# Altium schematic sheet charcer-wiht-stm32.SchDoc
size A4
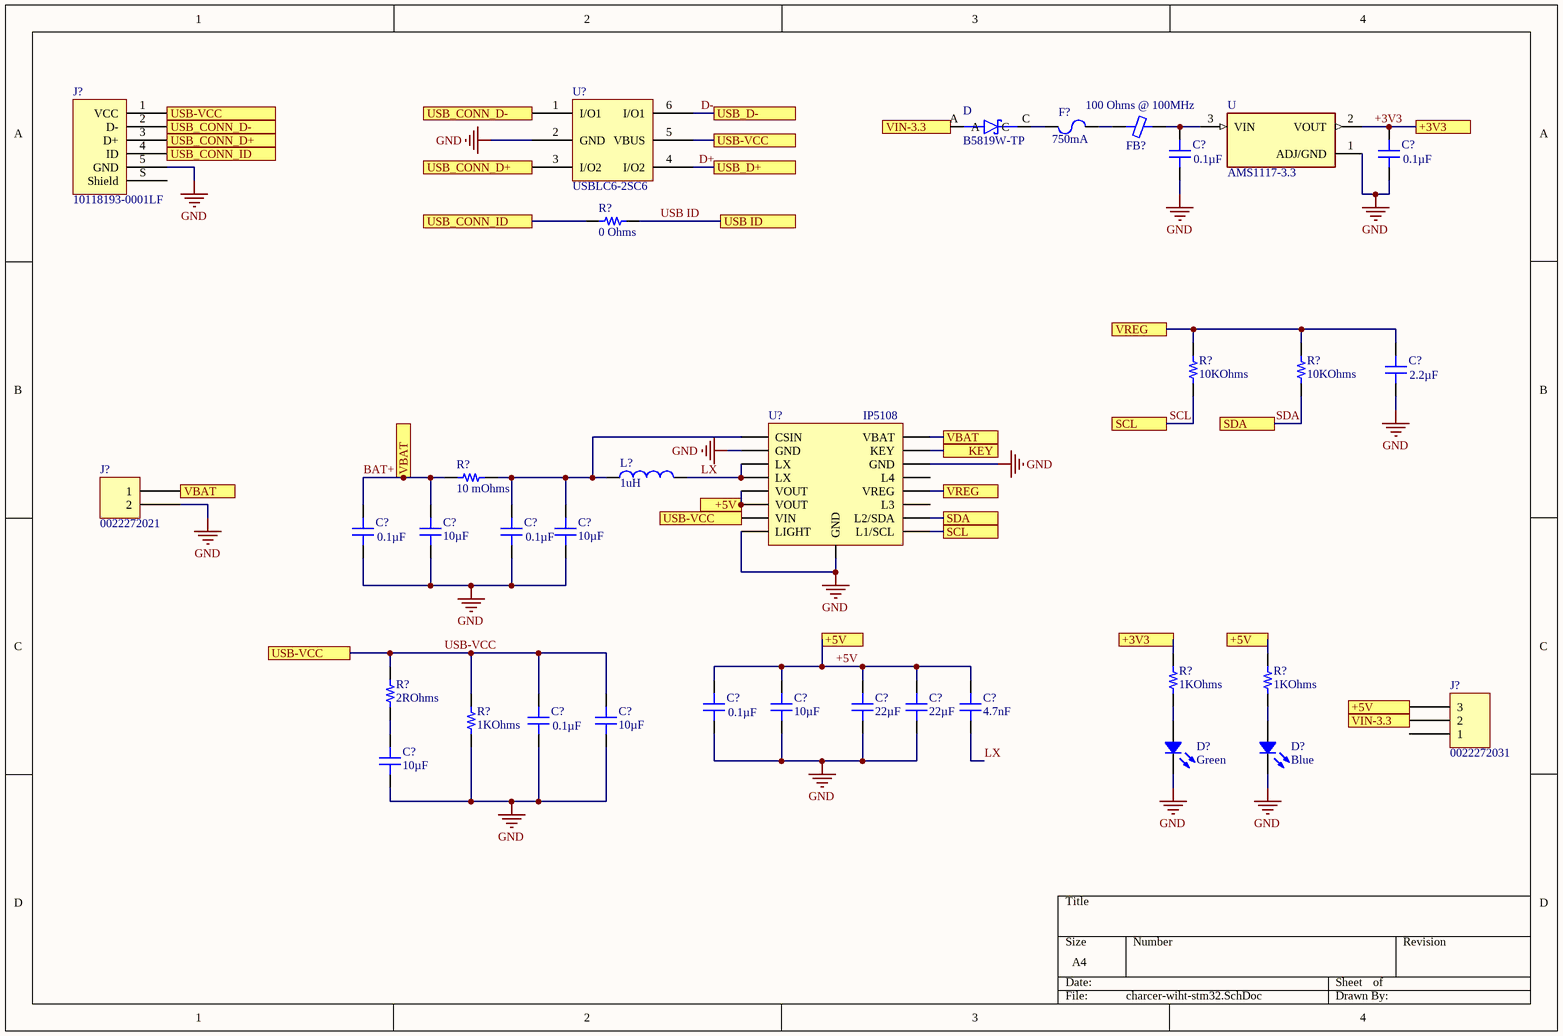
[diagram p0: charcer-wiht-stm32.SchDoc]

## Parts
(Parts that share a designator on the sheet are numbered #1, #2 ... from top to bottom, then left to right.)
C?#1  0.1µF  [CAP 0805_2012]
C?#2  0.1µF  [CAP 0805_2012]
C?#3  2.2µF  [CAP 0805_2012]
C?#4  0.1µF  [CAP 0805_2012]
C?#5  10µF  [CAP 0805_2012]
C?#6  0.1µF  [CAP 0805_2012]
C?#7  10µF  [CAP 0805_2012]
C?#8  0.1µF  [CAP 0805_2012]
C?#9  10µF  [CAP 0805_2012]
C?#10  22µF  [CAP 1206_3216 - 1.8MM]
C?#11  22µF  [CAP 1206_3216 - 1.8MM]
C?#12  4.7nF  [CAP 0805_2012]
C?#13  0.1µF  [CAP 0805_2012]
C?#14  10µF  [CAP 0805_2012]
C?#15  10µF  [CAP 0805_2012]
D  B5819W-TP  [SOD3716X135N]
D?#1  Green  [LED 0805_2012 GREEN]
D?#2  Blue  [LED 0805_2012 BLUE]
F?  750mA  [FUSE 1206_3216 0.6MM]
FB?  100 Ohms @ 100MHz  [FER 0805_2012]
J?#1  10118193-0001LF  [FCI USB 10118193-0001LF]
J?#2  0022272021  [MOLEX KK 0022272021]
J?#3  0022272031  [MOLEX KK 0022272031]
L?  1uH  [INDM7666X50N]
R?#1  0 Ohms  [RES 0402_1005]
R?#2  10KOhms  [RES 0805_2012]
R?#3  10KOhms  [RES 0805_2012]
R?#4  10 mOhms  [RES 0805_2012]
R?#5  1KOhms  [RES 0805_2012]
R?#6  1KOhms  [RES 0805_2012]
R?#7  2ROhms  [RES 0805_2012]
R?#8  1KOhms  [RES 0805_2012]
U  AMS1117-3.3  [SOT229P700X180-4N]
U?#1  USBLC6-2SC6  [SOT23-6L]
U?#2  IP5108  [SOP-16_150mil]

## Ports
+3V3, +5V, KEY, SCL, SDA, USB ID, USB-VCC, USB_CONN_D+, USB_CONN_D-, USB_CONN_ID, USB_D+, USB_D-, VBAT, VIN-3.3, VREG

## Nets
GND: C?#1.1 C?#2.1 C?#3.1 C?#4.1 C?#5.1 C?#6.1 C?#7.1 C?#8.1 C?#9.1 C?#10.1 C?#11.1 C?#13.1 C?#14.1 C?#15.1 D?#1.2 D?#2.2 J?#1.5(GND) J?#2.2 R?#8.2 U.1(ADJ/GND) U?#1.2(GND) U?#2.2(GND) U?#2.8(LIGHT) U?#2.14(GND) U?#2.17(GND)
+3V3: C?#2.2 R?#5.1 U.2(VOUT) ; port +3V3
+5V: C?#8.2 C?#9.2 C?#10.2 C?#11.2 C?#12.2 J?#3.3 R?#6.1 U?#2.5(VOUT) U?#2.6(VOUT) ; port +5V
BAT+: C?#4.2 C?#5.2 J?#2.1 R?#4.1 U?#2.16(VBAT) ; port VBAT
D+: U?#1.4(I/O2) ; port USB_D+
D-: U?#1.6(I/O1) ; port USB_D-
KEY: U?#2.15(KEY) ; port KEY
LX: C?#12.1 L?.1 U?#2.3(LX) U?#2.4(LX)
SCL: R?#2.2 U?#2.9(L1/SCL) ; port SCL
SDA: R?#3.2 U?#2.10(L2/SDA) ; port SDA
USB ID: R?#1.2 ; port USB ID
USB-VCC: C?#13.2 C?#14.2 J?#1.1(VCC) R?#7.1 R?#8.1 U?#1.5(VBUS) U?#2.7(VIN) ; port USB-VCC
USB_CONN_D+: J?#1.3(D+) U?#1.3(I/O2) ; port USB_CONN_D+
USB_CONN_D-: J?#1.2(D-) U?#1.1(I/O1) ; port USB_CONN_D-
USB_CONN_ID: J?#1.4(ID) R?#1.1 ; port USB_CONN_ID
VIN-3.3: D.A J?#3.2 ; port VIN-3.3
VREG: C?#3.2 R?#2.1 R?#3.1 U?#2.12(VREG) ; port VREG
NetC?#1_2: C?#1.2 FB?.2 U.3(VIN)
NetC?#6_2: C?#6.2 C?#7.2 L?.2 R?#4.2 U?#2.1(CSIN)
NetC?#15_2: C?#15.2 R?#7.2
NetD?#1_1: D?#1.1 R?#5.2
NetD?#2_1: D?#2.1 R?#6.2
NetD_C: D.C F?.1
NetF?_2: F?.2 FB?.1

Not connected (* = marked no-connect by the designer): J?#1 S(Shield); J?#3 1; U?#2 11(L3) 13(L4)

## Library data of the parts
C?#1 C?#2 C?#4 C?#6 C?#8 C?#13 = VJ0805Y104KFAAT: CAP CER 0.1UF 50V X7R 0805; Manufacturer: Vishay Vitramon; Tolerance: ±10%; Part Number: VJ0805Y104KFAAT; Value: 0.1µF; Applications: General Purpose; Capacitance: 0.1µF; ComponentLink1Description: Datasheet; ComponentLink1URL: http://www.vishay.com/docs/45199/vjcommercialseries.pdf; ComponentLink2Description: DigiKey Link; ComponentLink2URL: http://digikey.com/product-detail/en/vishay-vitramon/VJ0805Y104KFAAT/720-1753-1-ND/8324173; Device Package: 0805 (2012 Metric); LastUpdated: 2.9.2020 01:04:40; Lifecycle Status: Active; Minimum Order: 1; Mounting Type: Surface Mount, MLCC; Operating Temperature: -55°C ~ 150°C; Package / Case: 0805 (2012 Metric); Packaging: TapeAndReel; PartId: 3420; Part Status: Active; Price: 0.18; Series: VJ; Size / Dimension: 0.079" L x 0.049" W (2.00mm x 1.25mm); Supplier 1: DigiKey; Supplier Part Number 1: 720-1753-1-ND; Temperature Coefficient: X7R; Thickness (Max): 0.057" (1.45mm); Voltage - Rated: 50V
C?#3 = VJ0805Y104KFAAT: CAP CER 0.1UF 50V X7R 0805; Manufacturer: Vishay Vitramon; Capacitance: 0.1µF; Tolerance: ±10%; Part Number: VJ0805Y104KFAAT; Value: 2.2µF; Applications: General Purpose; ComponentLink1Description: Datasheet; ComponentLink1URL: http://www.vishay.com/docs/45199/vjcommercialseries.pdf; ComponentLink2Description: DigiKey Link; ComponentLink2URL: http://digikey.com/product-detail/en/vishay-vitramon/VJ0805Y104KFAAT/720-1753-1-ND/8324173; Device Package: 0805 (2012 Metric); LastUpdated: 2.9.2020 01:04:40; Lifecycle Status: Active; Minimum Order: 1; Mounting Type: Surface Mount, MLCC; Operating Temperature: -55°C ~ 150°C; Package / Case: 0805 (2012 Metric); Packaging: TapeAndReel; PartId: 3420; Part Status: Active; Price: 0.18; Series: VJ; Size / Dimension: 0.079" L x 0.049" W (2.00mm x 1.25mm); Supplier 1: DigiKey; Supplier Part Number 1: 720-1753-1-ND; Temperature Coefficient: X7R; Thickness (Max): 0.057" (1.45mm); Voltage - Rated: 50V
C?#5 C?#7 C?#9 C?#14 C?#15 = CL21X106KAYNNNE: CAP CER 10UF 25V X6S 0805; Manufacturer: Samsung Electro-Mechanics; Tolerance: ±10%; Part Number: CL21X106KAYNNNE; Value: 10µF; Applications: General Purpose; Capacitance: 10µF; ComponentLink1Description: Datasheet; ComponentLink1URL: http://www.samsungsem.com/kr/support/product-search/mlcc/CL21X106KAYNNNE.jsp; ComponentLink2Description: DigiKey Link; ComponentLink2URL: http://digikey.com/product-detail/en/samsung-electro-mechanics/CL21X106KAYNNNE/1276-6698-1-ND/5961557; Device Package: 0805 (2012 Metric); LastUpdated: 2.9.2020 01:04:38; Lifecycle Status: Active; Minimum Order: 1; Mounting Type: Surface Mount, MLCC; Operating Temperature: -55°C ~ 105°C; Package / Case: 0805 (2012 Metric); Packaging: TapeAndReel; PartId: 4781; Part Status: Active; Price: 0.06; Series: CL; Size / Dimension: 0.079" L x 0.049" W (2.00mm x 1.25mm); Supplier 1: DigiKey; Supplier Part Number 1: 1276-6698-1-ND; Temperature Coefficient: X6S; Thickness (Max): 0.057" (1.45mm); Voltage - Rated: 25V
C?#10 C?#11 = EMK316ABJ226KL-T: CAP CER 22UF 16V X5R 1206; Manufacturer: Taiyo Yuden; Tolerance: ±10%; Part Number: EMK316ABJ226KL-T; Value: 22µF; Applications: General Purpose; Capacitance: 22µF; ComponentLink1Description: Datasheet; ComponentLink1URL: https://www.yuden.co.jp/productdata/catalog/mlcc01_e.pdf; ComponentLink2Description: DigiKey Link; ComponentLink2URL: http://digikey.com/product-detail/en/taiyo-yuden/EMK316ABJ226KL-T/587-5521-1-ND/7067197; Device Package: 1206 (3216 Metric); LastUpdated: 2.9.2020 01:05:31; Lifecycle Status: Active; Minimum Order: 1; Mounting Type: Surface Mount, MLCC; Operating Temperature: -55°C ~ 85°C; Package / Case: 1206 (3216 Metric); Packaging: TapeAndReel; PartId: 21826; Part Status: Active; Price: 0.11; Series: M; Size / Dimension: 0.126" L x 0.063" W (3.20mm x 1.60mm); Supplier 1: DigiKey; Supplier Part Number 1: 587-5521-1-ND; Temperature Coefficient: X5R; Thickness (Max): 0.071" (1.80mm); Voltage - Rated: 16V
C?#12 = CL21X106KAYNNNE: CAP CER 10UF 25V X6S 0805; Manufacturer: Samsung Electro-Mechanics; Capacitance: 10µF; Tolerance: ±10%; Part Number: CL21X106KAYNNNE; Value: 4.7nF; Applications: General Purpose; ComponentLink1Description: Datasheet; ComponentLink1URL: http://www.samsungsem.com/kr/support/product-search/mlcc/CL21X106KAYNNNE.jsp; ComponentLink2Description: DigiKey Link; ComponentLink2URL: http://digikey.com/product-detail/en/samsung-electro-mechanics/CL21X106KAYNNNE/1276-6698-1-ND/5961557; Device Package: 0805 (2012 Metric); LastUpdated: 2.9.2020 01:04:38; Lifecycle Status: Active; Minimum Order: 1; Mounting Type: Surface Mount, MLCC; Operating Temperature: -55°C ~ 105°C; Package / Case: 0805 (2012 Metric); Packaging: TapeAndReel; PartId: 4781; Part Status: Active; Price: 0.06; Series: CL; Size / Dimension: 0.079" L x 0.049" W (2.00mm x 1.25mm); Supplier 1: DigiKey; Supplier Part Number 1: 1276-6698-1-ND; Temperature Coefficient: X6S; Thickness (Max): 0.057" (1.45mm); Voltage - Rated: 25V
D = B5819W-TP: Diode Schottky 20V 1A Surface Mount SOD-123; MF: Micro Commercial; Value: *; MP: B5819W-TP; SnapEDA_Link: https://www.snapeda.com/parts/B5819W-TP/Micro%20Commercial/view-part/214542/?ref=snap; Availability: Unavailable; Package: SOD-123 MCC; Price: None
D?#1 = SM0805UGC: LED GREEN CLEAR 0805 SMD; Manufacturer: Bivar Inc.; Configuration: Standard; Current - Test: 20mA; Lens Color: Colorless; Lens Size: 1.40mm x 1.20mm; Lens Style: Rectangle with Flat Top; Millicandela Rating: 10mcd; Viewing Angle: 130°; Voltage - Forward (Vf) (Typ): 2V; Wavelength - Dominant: 565nm; Wavelength - Peak: 563nm; Part Number: SM0805UGC; Color: Green; ComponentLink1Description: Datasheet; ComponentLink1URL: https://www.bivar.com/Files/Datasheets/SM0805UGC.pdf; ComponentLink2Description: DigiKey Link; ComponentLink2URL: http://digikey.com/product-detail/en/bivar-inc/SM0805UGC/492-1329-1-ND/2408561; Device Package: 0805 (2012 Metric); Height (Max): 1.10mm; LastUpdated: 2.9.2020 01:21:05; Lens Transparency: Clear; Lifecycle Status: Active; Minimum Order: 1; Mounting Type: Surface Mount; Package / Case: 0805 (2012 Metric); Packaging: TapeAndReel; PartId: 247; Part Status: Active; Price: 0.18; Series: -; Size / Dimension: 2.00mm L x 1.20mm W; Supplier 1: DigiKey; Supplier Part Number 1: 492-1329-1-ND; Supplier Device Package: 0805; Value: Green
D?#2 = HSMN-C170: LED BLUE DIFFUSED CHIP SMD; Manufacturer: Broadcom Limited; Configuration: Standard; Current - Test: 20mA; Lens Color: White; Lens Size: 1.40mm x 1.25mm; Lens Style: Rectangle with Flat Top; Millicandela Rating: 35mcd; Viewing Angle: 170°; Voltage - Forward (Vf) (Typ): 3.3V; Wavelength - Dominant: 470nm; Wavelength - Peak: 468nm; Part Number: HSMN-C170; Color: Blue; ComponentLink1Description: Datasheet; ComponentLink1URL: https://docs.broadcom.com/docs/AV02-0592EN; ComponentLink2Description: DigiKey Link; ComponentLink2URL: http://digikey.com/product-detail/en/broadcom-limited/HSMN-C170/516-1437-1-ND/637761; Device Package: 0805 (2012 Metric); Height (Max): 0.80mm; LastUpdated: 2.9.2020 01:20:30; Lens Transparency: Diffused; Lifecycle Status: Active; Minimum Order: 1; Mounting Type: Surface Mount; Package / Case: 0805 (2012 Metric); Packaging: TapeAndReel; PartId: 770; Part Status: Active; Price: 0.28; Series: -; Size / Dimension: 2.00mm L x 1.25mm W; Supplier 1: DigiKey; Supplier Part Number 1: 516-1437-1-ND; Supplier Device Package: Chip LED; Value: Blue
F? = 3413.0114.22: FUSE BOARD MNT 750MA 32VAC 63VDC; Manufacturer: Schurter Inc.; Approval Agency: cURus; Breaking Capacity @ Rated Voltage: 50A; Fuse Type: Board Mount (Cartridge Style Excluded); Melting I²t: 0.05; Response Time: Fast Blow; Voltage Rating - AC: 32V; Voltage Rating - DC: 63V; Part Number: 3413.0114.22; Approvals: cURus; ComponentLink1Description: Datasheet; ComponentLink1URL: http://www.schurterinc.com/bundles/snceschurter/epim/_ProdPool_/newDS/en/typ_USF_1206.pdf; ComponentLink2Description: DigiKey Link; ComponentLink2URL: http://digikey.com/product-detail/en/schurter-inc/3413.0114.22/486-1676-1-ND/2870076; Current Rating (Amps): 750mA; Device Package: 1206 (3216 Metric); LastUpdated: 2.9.2020 01:30:41; Lifecycle Status: Active; Minimum Order: 1; Mounting Type: Surface Mount; Operating Temperature: -55°C ~ 90°C; Package / Case: 1206 (3216 Metric); Packaging: TapeAndReel; Part Status: Active; Price: 0.24; Series: USF 1206; Size / Dimension: 0.126" L x 0.063" W x 0.024" H (3.20mm x 1.60mm x 0.60mm); Supplier 1: DigiKey; Supplier Part Number 1: 486-1676-1-ND
FB? = MH2029-101Y: FERRITE BEAD 100 OHM 0805 1LN; Manufacturer: Bourns Inc.; Current Rating (Max): 2A; DC Resistance (DCR) (Max): 100mOhm; Filter Type: Power, Signal Line; Number of Lines: 1; Part Number: MH2029-101Y; ComponentLink1Description: Datasheet; ComponentLink1URL: https://www.bourns.com/docs/Product-Datasheets/mh.pdf; ComponentLink2Description: DigiKey Link; ComponentLink2URL: http://digikey.com/product-detail/en/bourns-inc/MH2029-101Y/MH2029-101YCT-ND/6100092; Device Package: 0805 (2012 Metric); Height (Max): 0.043" (1.10mm); Impedance @ Frequency: 100 Ohms @ 100MHz; LastUpdated: 2.9.2020 01:18:23; Lifecycle Status: Active; Minimum Order: 1; Mounting Type: Surface Mount; Operating Temperature: -55°C ~ 125°C; Package / Case: 0805 (2012 Metric); Packaging: TapeAndReel; PartId: 1212; Part Status: Active; Price: 0.02; Series: MH; Size / Dimension: 0.079" L x 0.047" W (2.00mm x 1.20mm); Supplier 1: DigiKey; Supplier Part Number 1: MH2029-101YCT-ND; Value: 100 Ohms @ 100MHz
J?#1 = 10118193-0001LF: CONN RCPT USB2.0 MICRO B SMD R/A; Manufacturer: Amphenol ICC (FCI); Connector Type: USB - micro B; Current Rating (Amps): 1.8A per Contact; Gender: Receptacle; Mating Cycles: 10000; Number of Contacts: 5; Number of Ports: 1; Shielding: Shielded; Voltage - Rated: 100VAC; Part Number: 10118193-0001LF; ComponentLink1Description: Datasheet; ComponentLink1URL: https://cdn.amphenol-icc.com/media/wysiwyg/files/documentation/datasheet/inputoutput/io_usb_micro.pdf; ComponentLink2Description: DigiKey Link; ComponentLink2URL: //digikey.com/product-detail/en/amphenol-icc-fci/10118193-0001LF/609-4616-2-ND/2785388; Features: Solder Retention; LastUpdated: 9.12.2019 20:51:28; Lifecycle Status: 0; Minimum Order: 1; Mounting Feature: Horizontal; Mounting Type: Surface Mount, Right Angle; Through Hole; Operating Temperature: -30°C ~ 80°C; Packaging: TapeAndReel; Part Status: Active; Price: 0.21; Series: -; Specifications: USB 2.0; Supplier 1: DigiKey; Supplier Part Number 1: 609-4616-2-ND; Termination: Solder
J?#2 = 0022272021: CONN HEADER VERT 2POS 2.54MM; Manufacturer: Molex; Contact Length - Mating: 0.295" (7.49mm); Contact Length - Post: 0.140" (3.56mm); Material Flammability Rating: UL94 V-0; Number of Positions: 2; Number of Positions Loaded: All; Overall Contact Length: 0.560" (14.22mm); Pitch - Mating: 0.100" (2.54mm); Shrouding: Shrouded - 1 Wall; Style: Board to Cable/Wire; Part Number: 0022272021; ComponentLink1Description: Datasheet; ComponentLink1URL: https://www.molex.com/pdm_docs/sd/022272021_sd.pdf; ComponentLink2Description: DigiKey Link; ComponentLink2URL: http://digikey.com/product-detail/en/molex/0022272021/WM4111-ND/1130577; Connector Type: Header; Contact Finish - Mating: Tin; Contact Finish - Post: Tin; Contact Finish Thickness - Mating: 100.0µin (2.54µm); Contact Material: Brass; Contact Shape: Square; Contact Type: Male Pin; Fastening Type: Friction Lock; Insulation Color: Natural; Insulation Height: 0.461" (11.70mm); Insulation Material: Polyamide (PA), Nylon; LastUpdated: 12.1.2020 23:51:43; Lifecycle Status: Active; Minimum Order: 1; Mounting Type: Through Hole; Number of Rows: 1; Packaging: Bulk; PartId: 76; Part Status: Active; Price: 0.27; Series: KK 6410; Supplier 1: DigiKey; Supplier Part Number 1: WM4111-ND; Termination: Solder
J?#3 = 0022272031: CONN HEADER VERT 3POS 2.54MM; Manufacturer: Molex; Contact Length - Mating: 0.295" (7.49mm); Contact Length - Post: 0.140" (3.56mm); Material Flammability Rating: UL94 V-0; Number of Positions: 3; Number of Positions Loaded: All; Overall Contact Length: 0.560" (14.22mm); Pitch - Mating: 0.100" (2.54mm); Shrouding: Shrouded - 1 Wall; Style: Board to Cable/Wire; Part Number: 0022272031; ComponentLink1Description: Datasheet; ComponentLink1URL: https://www.molex.com/pdm_docs/sd/022272031_sd.pdf; ComponentLink2Description: DigiKey Link; ComponentLink2URL: http://digikey.com/product-detail/en/molex/0022272031/WM4112-ND/1130578; Connector Type: Header; Contact Finish - Mating: Tin; Contact Finish - Post: Tin; Contact Finish Thickness - Mating: 100.0µin (2.54µm); Contact Material: Brass; Contact Shape: Square; Contact Type: Male Pin; Fastening Type: Friction Lock; Insulation Color: Natural; Insulation Height: 0.461" (11.70mm); Insulation Material: Polyamide (PA), Nylon; LastUpdated: 12.1.2020 23:51:54; Lifecycle Status: Active; Minimum Order: 1; Mounting Type: Through Hole; Number of Rows: 1; Packaging: Bulk; PartId: 77; Part Status: Active; Price: 0.37; Series: KK 6410; Supplier 1: DigiKey; Supplier Part Number 1: WM4112-ND; Termination: Solder
L? = SMPI06050-1R0M: Fixed Inductors .1uH 20%; Manufacturer: CORE MASTER; Core Material: Ferrite; DC Resistance (DCR): 7mR; Shielding: Shielded; Inductance: 100nH; Max DC Current: 40A; Test Frequency: 100kHz; Current Rating: 18A; Self Resonant Frequency: 5MHz; Resistance: 3mR; Supplier 1: ozdisan; Manufacturer Part Number: SMPI06050-1R0M; RoHS: Yes; Category: Fixed Inductors; Mount: Surface Mount; Case/Package: NONSTANDARD; Number of Pins: 2; Case Code (Imperial): 2525; Case Code (Metric): 6363; Min Operating Temperature: -55°C; Max Operating Temperature: 125°C; Package Quantity: 2000; Packaging: Tape and Reel; Termination: SMD/SMT; Tolerance: 20%; Saturation Current: 40A; Inductance Tolerance: 20%; RMS Current (Irms): 18A; Length: 6.86mm; Width: 0.255inch; Height: 1.8mm; Height - Seated (Max): 0.071inch; Depth: 6.72mm; Radiation Hardening: No; Lead Free: Lead Free; REACH SVHC: Unknown; ComponentLink1URL: https://datasheet.ciiva.com/11798/0900766b8102c932-11798378.pdf?src-supplier=RSComponents; ComponentLink1Description: https://datasheet.ciiva.com/11798/0900766b8102c932-11798378.pdf?src-supplier=RSComponents; ComponentLink2URL: https://datasheet.ciiva.com/1076/ih25ah01-1076900.pdf?src-supplier=Digi-Key; ComponentLink2Description: https://datasheet.ciiva.com/1076/ih25ah01-1076900.pdf?src-supplier=Digi-Key; ComponentLink3URL: https://datasheet.ciiva.com/8017/425589-8017240.pdf?src-supplier=Element14; ComponentLink3Description: https://datasheet.ciiva.com/8017/425589-8017240.pdf?src-supplier=Element14; ComponentLink4URL: https://datasheet.ciiva.com/17269/ih25ah01-17269371.pdf?src-supplier=Avnet+Europe; ComponentLink4Description: https://datasheet.ciiva.com/17269/ih25ah01-17269371.pdf?src-supplier=Avnet+Europe; ComponentLink5URL: https://datasheet.ciiva.com/16460/ih25ah01-16460077.pdf?src-supplier=Future+Electronics; ComponentLink5Description: https://datasheet.ciiva.com/16460/ih25ah01-16460077.pdf?src-supplier=Future+Electronics; ComponentLink6URL: https://datasheet.ciiva.com/8496/ih25ah01-8496206.pdf?src-supplier=Avnet; ComponentLink6Description: https://datasheet.ciiva.com/8496/ih25ah01-8496206.pdf?src-supplier=Avnet; Stock 1: 2000; Supplier Part Number 1: SMPI06050-1R0M
R?#1 = CRCW04020000Z0EDHP: RES SMD 0 OHM JUMPER 1/5W 0402; Manufacturer: Vishay Dale; Power (Watts): 0.2W, 1/5W; Part Number: CRCW04020000Z0EDHP; Value: 0 Ohms; ComponentLink1Description: Datasheet; ComponentLink1URL: http://www.vishay.com/docs/20043/crcwhpe3.pdf; ComponentLink2Description: DigiKey Link; ComponentLink2URL: http://digikey.com/product-detail/en/vishay-dale/CRCW04020000Z0EDHP/541-0.0YBCT-ND/2223008; Composition: Thick Film; Device Package: 0402 (1005 Metric); Features: Automotive AEC-Q200, Pulse Withstanding; Height - Seated (Max): 0.016" (0.40mm); LastUpdated: 2.9.2020 01:08:09; Lifecycle Status: Active; Minimum Order: 1; Number of Terminations: 2; Operating Temperature: -55°C ~ 155°C; Package / Case: 0402 (1005 Metric); Packaging: TapeAndReel; PartId: 3131; Part Status: Active; Price: 0.01; Ratings: AEC-Q200; Resistance: 0 Ohms; Series: CRCW-HP; Size / Dimension: 0.039" L x 0.020" W (1.00mm x 0.50mm); Supplier 1: DigiKey; Supplier Part Number 1: 541-0.0YBCT-ND; Supplier Device Package: 0402; Tolerance: Jumper
R?#2 R?#3 R?#5-R?#8 = RL0805FR-070R01L: RES 0.01 OHM 1% 1/8W 0805; Manufacturer: Yageo; Power (Watts): 0.125W, 1/8W; Resistance: 10 mOhms; Temperature Coefficient: ±1500ppm/°C; Part Number: RL0805FR-070R01L; ComponentLink1Description: Datasheet; ComponentLink1URL: http://www.yageo.com/documents/recent/PYu-RL_Group_521_RoHS_L_2.pdf; ComponentLink2Description: DigiKey Link; ComponentLink2URL: http://digikey.com/product-detail/en/yageo/RL0805FR-070R01L/311-0.01SCT-ND/2827993; Composition: Thick Film; Device Package: 0805 (2012 Metric); Features: Automotive AEC-Q200, Current Sense, Moisture Resistant; Height - Seated (Max): 0.024" (0.60mm); LastUpdated: 2.9.2020 01:15:18; Lifecycle Status: Active; Minimum Order: 1; Number of Terminations: 2; Operating Temperature: -55°C ~ 155°C; Package / Case: 0805 (2012 Metric); Packaging: TapeAndReel; PartId: 30376; Part Status: Active; Price: 0.09; Ratings: AEC-Q200; Series: RL; Size / Dimension: 0.079" L x 0.049" W (2.00mm x 1.25mm); Supplier 1: DigiKey; Supplier Part Number 1: 311-0.01SCT-ND; Supplier Device Package: 0805; Tolerance: ±1%
  R?#2 R?#3: Value: 10KOhms
  R?#5 R?#6 R?#8: Value: 1KOhms
  R?#7: Value: 2ROhms
R?#4 = RL0805FR-070R01L: RES 0.01 OHM 1% 1/8W 0805; Manufacturer: Yageo; Power (Watts): 0.125W, 1/8W; Temperature Coefficient: ±1500ppm/°C; Part Number: RL0805FR-070R01L; Value: 10 mOhms; ComponentLink1Description: Datasheet; ComponentLink1URL: http://www.yageo.com/documents/recent/PYu-RL_Group_521_RoHS_L_2.pdf; ComponentLink2Description: DigiKey Link; ComponentLink2URL: http://digikey.com/product-detail/en/yageo/RL0805FR-070R01L/311-0.01SCT-ND/2827993; Composition: Thick Film; Device Package: 0805 (2012 Metric); Features: Automotive AEC-Q200, Current Sense, Moisture Resistant; Height - Seated (Max): 0.024" (0.60mm); LastUpdated: 2.9.2020 01:15:18; Lifecycle Status: Active; Minimum Order: 1; Number of Terminations: 2; Operating Temperature: -55°C ~ 155°C; Package / Case: 0805 (2012 Metric); Packaging: TapeAndReel; PartId: 30376; Part Status: Active; Price: 0.09; Ratings: AEC-Q200; Resistance: 10 mOhms; Series: RL; Size / Dimension: 0.079" L x 0.049" W (2.00mm x 1.25mm); Supplier 1: DigiKey; Supplier Part Number 1: 311-0.01SCT-ND; Supplier Device Package: 0805; Tolerance: ±1%
U = AMS1117-3.3: Sot223/Pkg 1-Amp 3.3-Volt Low Drop Out Voltage Regulatator; MF: Advanced Monolithic Systems; Price: None; Package: None; Value: *; MP: AMS1117-3.3; Availability: Unavailable; SnapEDA_Link: https://www.snapeda.com/parts/AMS1117-3.3/Advanced%20Monolithic%20Systems/view-part/53450/?ref=snap
U?#1 = USBLC6-2SC6: USBLC6 Series 4 Line 6 V Uni / Bi-Directional ESD Protection - SOT-23-6; Manufacturer: STMicroelectronics; Capacitance: 4pF; Direction: Unidirectional; Clamping Voltage: 17V; Number of Bidirectional Channels: 4; Reverse Standoff Voltage: 5V; Min Breakdown Voltage: 6V; Power Line Protection: Yes; Leakage Current: 150nA; Peak Pulse Current: 5A; Operating Supply Voltage: 860mV; Test Current: 1mA; Max Reverse Leakage Current: 2uA; Number of Elements: 1; Polarity: Unidirectional,Bidirectional; Max Breakdown Voltage: 10V; Supplier 1: Avnet; Manufacturer Part Number: USBLC6-2SC6; RoHS: Yes; Category: ESD and Circuit Protection ICs; Stock 1: 147000; Pricing 1: 3000=0,24113, 6000=0,23936, 12000=0,23732, 18000=0,23404, 24000=0,23049, 30000=0,22872, 300000=0,22694 (USD); Mount: Surface Mount; Case/Package: SOT-23; Number of Pins: 6; Contact Plating: Tin,Matte; Weight: 0.01lb; Min Operating Temperature: -40°C; Max Operating Temperature: 125°C; Package Quantity: 3000; Packaging: Tape and Reel; Number of Channels: 4; Breakdown Voltage: 6V; Termination: SMD/SMT; ESD Protection: Yes; Reverse Breakdown Voltage: 6V; Working Voltage: 5V; Voltage Rating (DC): 5V; Length: 3mm; Width: 1.75mm; Height: 1.3mm; Depth: 1.75mm; Radiation Hardening: No; Lead Free: Lead Free; REACH SVHC: No SVHC; ComponentLink1URL: https://datasheet.ciiva.com/16206/cd00047494-16206119.pdf?src-supplier=Future+Electronics; ComponentLink1Description: https://datasheet.ciiva.com/16206/cd00047494-16206119.pdf?src-supplier=Future+Electronics; ComponentLink2URL: https://datasheet.ciiva.com/14186/usblc6-4-st-eng-tds-14186570.pdf?src-supplier=Distrelec; ComponentLink2Description: https://datasheet.ciiva.com/14186/usblc6-4-st-eng-tds-14186570.pdf?src-supplier=Distrelec; ComponentLink3URL: https://datasheet.ciiva.com/4507/cd00047494-112581-4507757.pdf?src-supplier=Mouser; ComponentLink3Description: https://datasheet.ciiva.com/4507/cd00047494-112581-4507757.pdf?src-supplier=Mouser; ComponentLink4URL: https://datasheet.ciiva.com/27052/1493951-27052291.pdf?src-supplier=Jameco; ComponentLink4Description: https://datasheet.ciiva.com/27052/1493951-27052291.pdf?src-supplier=Jameco; ComponentLink5URL: https://datasheet.ciiva.com/15143/getdatasheetpartid-88767-15143364.pdf?src-supplier=Verical; ComponentLink5Description: https://datasheet.ciiva.com/15143/getdatasheetpartid-88767-15143364.pdf?src-supplier=Verical; ComponentLink6URL: https://datasheet.ciiva.com/1220/48344-1220005.pdf?src-supplier=Newark; ComponentLink6Description: https://datasheet.ciiva.com/1220/48344-1220005.pdf?src-supplier=Newark; ComponentLink7URL: https://datasheet.ciiva.com/26787/usblc6-4sc6-26787917.pdf?src-supplier=IIIC; ComponentLink7Description: https://datasheet.ciiva.com/26787/usblc6-4sc6-26787917.pdf?src-supplier=IIIC; ComponentLink8URL: https://datasheet.ciiva.com/22692/1498406-22692454.pdf?src-supplier=Element14; ComponentLink8Description: https://datasheet.ciiva.com/22692/1498406-22692454.pdf?src-supplier=Element14; ComponentLink9URL: https://datasheet.ciiva.com/22685/1498406-22685833.pdf?src-supplier=Element14; ComponentLink9Description: https://datasheet.ciiva.com/22685/1498406-22685833.pdf?src-supplier=Element14; Supplier Part Number 1: USBLC6-2SC6
U?#2 = IP5108: SOP-16_150mil PMIC - Battery Management RoHS; Manufacturer: INJOINIC; ComponentLink3Description: LCSC LINK; ComponentLink3URL: https://lcsc.com/product-detail/PMIC-Battery-Management_INJOINIC-IP5108_C180943.html; ComponentLink4Description: Datasheet; ComponentLink4URL: http://www.injoinic.com/wwwroot/uploads/files/20200221/5edb08a79152c9ee2ca8ea29a5d5ad25.pdf; Category: Battery Management; Package: SOP-16_150mil; RoHS: YES; LCSC Part #: C180943; Mfr.Part #: IP5108